# EAGLE design afron_atmega328_exp (EAGLE 6.1)
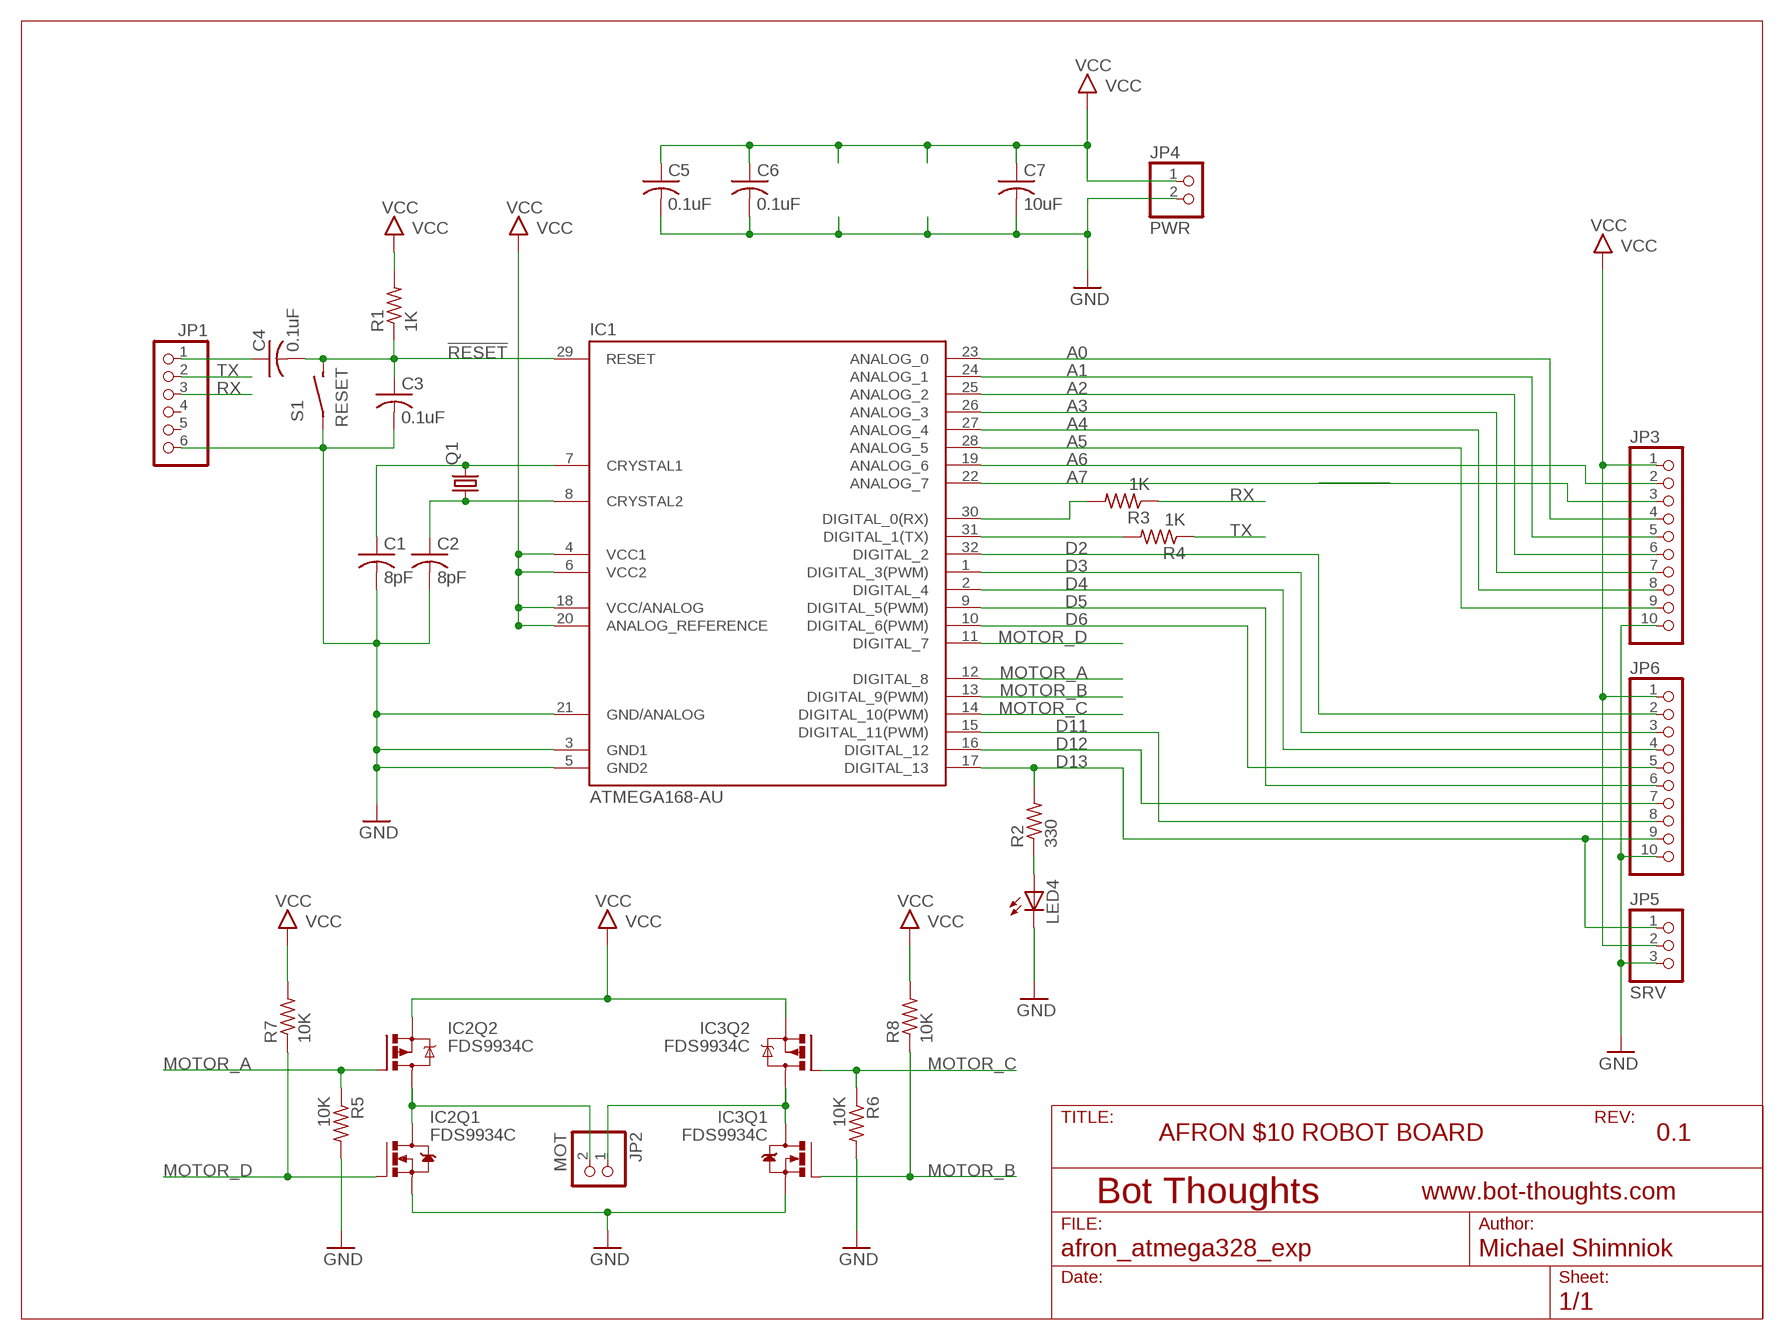
[diagram p0: schematic, sheet 1]

## Parts
C1  8pF  C-USC0603  [C0603]
C2  8pF  C-USC0603  [C0603]
C3  0.1uF  C-USC0603  [C0603]
C4  0.1uF  C-USC0603  [C0603]
C5  0.1uF  C-USC0603  [C0603]
C6  0.1uF  C-USC0603  [C0603]
C7  10uF  C-USC0805  [C0805]
IC1  ATMEGA168-AU  [TQFP32-08]
IC2  FDS9934C  [SOIC8]
IC3  FDS9934C  [SOIC8]
JP1  PINHD-1X06_2.54-S  [1X06-S]
JP2  MOT  PINHD-1X02_2.54-S  [1X02-S]
JP3  PINHD-1X10_2.54-S  [1X10-S]
JP4  PWR  PINHD-1X02_2.54-S  [1X02-S]
JP5  SRV  PINHD-1X03_2.54-S  [1X03-S]
JP6  PINHD-1X10_2.54-S  [1X10-S]
LED4  LEDSML0805  [SML0805]
Q1  CRYSTALNDK5X3  [NDK_2PAD_5X3]
R1  1K  R-US_R0603  [R0603]
R2  330  R-US_R0603  [R0603]
R3  1K  R-US_R0603  [R0603]
R4  1K  R-US_R0603  [R0603]
R5  10K  R-US_R0603  [R0603]
R6  10K  R-US_R0603  [R0603]
R7  10K  R-US_R0603  [R0603]
R8  10K  R-US_R0603  [R0603]
S1  RESET  SPST_TAC_RECT1  [6MMTACTILE_RECT]

## Nets
!RESET: C3.1 C4.2 IC1.29(RESET) R1.1 S1.P$2(S)
A0: IC1.23(ANALOG_0) JP3.4
A1: IC1.24(ANALOG_1) JP3.5
A2: IC1.25(ANALOG_2) JP3.6
A3: IC1.26(ANALOG_3) JP3.7
A4: IC1.27(ANALOG_4) JP3.8
A5: IC1.28(ANALOG_5) JP3.9
A6: IC1.19(ANALOG_6) JP3.2
A7: IC1.22(ANALOG_7) JP3.3
D2: IC1.32(DIGITAL_2) JP6.2
D3: IC1.1(DIGITAL_3(PWM)) JP6.3
D4: IC1.2(DIGITAL_4) JP6.4
D5: IC1.9(DIGITAL_5(PWM)) JP6.6
D6: IC1.10(DIGITAL_6(PWM)) JP6.5
D11: IC1.15(DIGITAL_11(PWM)) JP6.8
D12: IC1.16(DIGITAL_12) JP6.7
D13: IC1.17(DIGITAL_13) JP5.1 JP6.9 R2.2
GND: C1.2 C2.2 C5.2 C6.2 C7.2 IC1.3(GND1) IC1.5(GND2) IC1.21(GND/ANALOG) IC2.1(Q1:S) IC3.1(Q1:S) JP1.6 JP3.10 JP4.2 JP5.3 JP6.10 LED4.C R5.2 R6.2 S1.P$1(P)
MA: IC2.5(Q2:D) IC2.6(Q2:D) IC2.7(Q1:D) IC2.8(Q1:D) JP2.2
MB: IC3.5(Q2:D) IC3.6(Q2:D) IC3.7(Q1:D) IC3.8(Q1:D) JP2.1
MOTOR_A: IC1.12(DIGITAL_8) IC2.4(Q2:G) R5.1
MOTOR_B: IC1.13(DIGITAL_9(PWM)) IC3.2(Q1:G) R8.1
MOTOR_C: IC1.14(DIGITAL_10(PWM)) IC3.4(Q2:G) R6.1
MOTOR_D: IC1.11(DIGITAL_7) IC2.2(Q1:G) R7.1
N$2: C1.1 IC1.7(CRYSTAL1) Q1.P$2
N$3: C2.1 IC1.8(CRYSTAL2) Q1.P$1
N$4: C4.1 JP1.1
N$6: LED4.A R2.1
N$8: IC1.31(DIGITAL_1(TX)) R4.2
N$9: IC1.30(DIGITAL_0(RX)) R3.2
N$21: C3.2
RX: JP1.3 R3.1
TX: JP1.2 R4.1
VCC: C5.1 C6.1 C7.1 IC1.4(VCC1) IC1.6(VCC2) IC1.18(VCC/ANALOG) IC1.20(ANALOG_REFERENCE) IC2.3(Q2:S) IC3.3(Q2:S) JP3.1 JP4.1 JP5.2 JP6.1 R1.2 R7.2 R8.2
Unconnected: JP1.4 JP1.5

## Notes on the sheet
- AFRON $10 ROBOT BOARD | 0.1

## Library data of the parts
C1-C7 = rcl:C-US: CAPACITOR, American symbol
IC1 = Arduino-AVR:ATMEGA168
IC2 IC3 = mes_motor_driver:FDS9934C: Complementary MOSFET These dual N- and P-Channel enhancement mode power field effect transistors are produced using Fairchild Semiconductor’s advanced PowerTrench process that has been especially tailored to minimize on-state ressitance and yet maintain superior switching performance. These devices are well suited for low voltage and battery powered applications where low in-line power loss and fast switching are required. http://www.fairchildsemi.com/ds/FD/FDS9934C.pdf
JP1 = pinhead-2:PINHD-1X06: PIN HEADER
JP2 JP4 = pinhead-2:PINHD-1X02: PIN HEADER
JP3 JP6 = pinhead-2:PINHD-1X10: PIN HEADER
JP5 = pinhead-2:PINHD-1X03: PIN HEADER
LED4 = led:LED: LED OSRAM: - CHIPLED LG R971, LG N971, LY N971, LG Q971, LY Q971, LO R971, LY R971 LH N974, LH R974 LS Q976, LO Q976, LY Q976 LO Q996 - Hyper CHIPLED LW Q18S LB Q993, LB Q99A, LB R99A - SideLED LS A670, LO A670, LY A670, LG A670, LP A670 LB A673, LV A673, LT A673, LW A673 LH A674 LY A675 LS A676, LA A676, LO A676, LY A676, LW A676 LS A679, LY A679, LG A679 - Hyper Micro SIDELED® LS Y876, LA Y876, LO Y876, LY Y876 LT Y87S - SmartLED LW L88C, LW L88S LB L89C, LB L89S, LG L890 LS L89K, LO L89K, LY L89K LS L896, LA L896, LO L896, LY L896 - TOPLED LS T670, LO T670, LY T670, LG T670, LP T670 LSG T670, LSP T670, LSY T670, LOP T670, LYG T670 LG T671, LOG T671, LSG T671 LB T673, LV T673, LT T673, LW T673 LH T674 LS T676, LA T676, LO T676, LY T676, LB T676, LH T676, LSB T676, LW T676 LB T67C, LV T67C, LT T67C, LS T67K, LO T67K, LY T67K, LW E67C LS E67B, LA E67B, LO E67B, LY E67B, LB E67C, LV E67C, LT E67C LW T67C LS T679, LY T679, LG T679 LS T770, LO T770, LY T770, LG T770, LP T770 LB T773, LV T773, LT T773, LW T773 LH T774 LS E675, LA E675, LY E675, LS T675 LS T776, LA T776, LO T776, LY T776, LB T776 LHGB T686 LT T68C, LB T68C - Hyper Mini TOPLED® LB M676 - Mini TOPLED Santana® LG M470 LS M47K, LO M47K, LY M47K Source: http://www.osram.convergy.de LUXEON: - LUMILED® LXK2-PW12-R00, LXK2-PW12-S00, LXK2-PW14-U00, LXK2-PW14-V00 LXK2-PM12-R00, LXK2-PM12-S00, LXK2-PM14-U00 LXK2-PE12-Q00, LXK2-PE12-R00, LXK2-PE12-S00, LXK2-PE14-T00, LXK2-PE14-U00 LXK2-PB12-K00, LXK2-PB12-L00, LXK2-PB12-M00, LXK2-PB14-N00, LXK2-PB14-P00, LXK2-PB14-Q00 LXK2-PR12-L00, LXK2-PR12-M00, LXK2-PR14-Q00, LXK2-PR14-R00 LXK2-PD12-Q00, LXK2-PD12-R00, LXK2-PD12-S00 LXK2-PH12-R00, LXK2-PH12-S00 LXK2-PL12-P00, LXK2-PL12-Q00, LXK2-PL12-R00 Source: www.luxeon.com KINGBRIGHT: KA-3528ASYC Source: www.kingbright.com
Q1 = mes_crystal:CRYSTAL: CRYSTAL
R1-R8 = resistor:R-US_: RESISTOR, American symbol
S1 = mes_electromech:SPST: SPST SWITCH

## Board
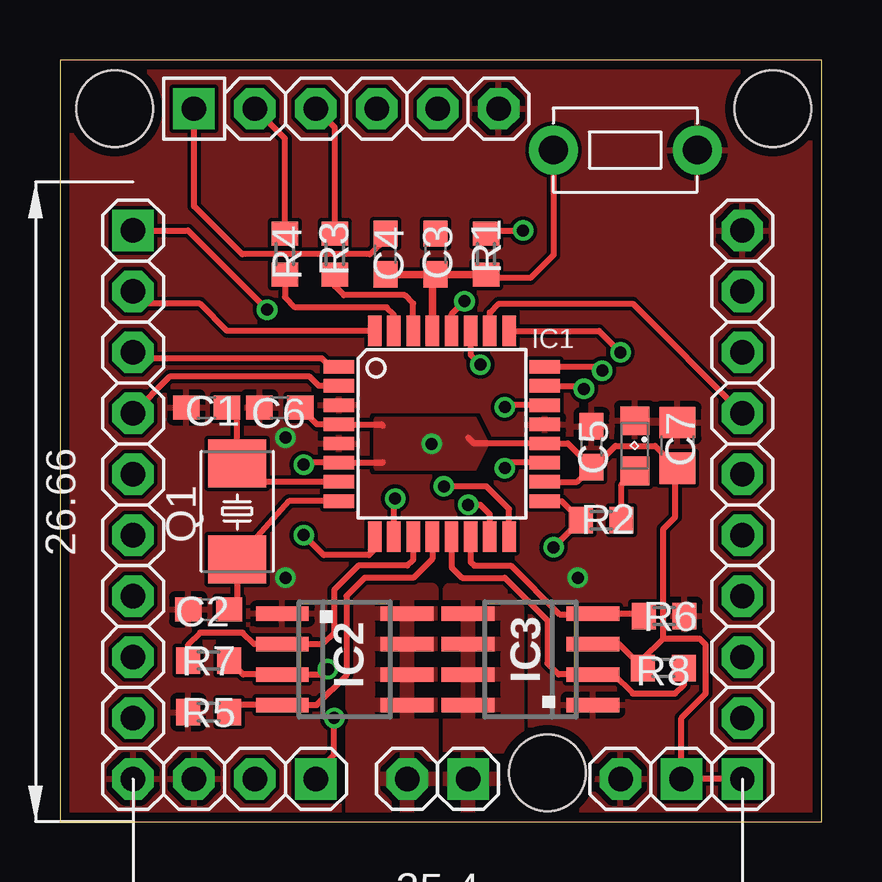
[diagram p1: board, top side]
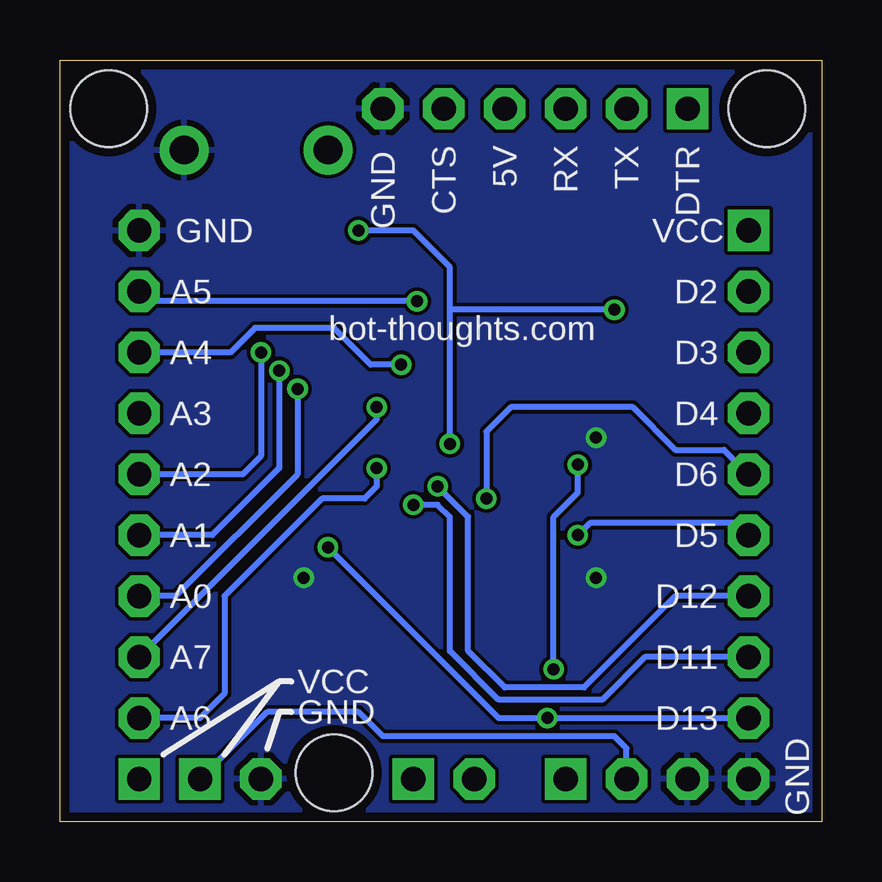
[diagram p2: board, bottom side, seen from below]

Size 31.75 x 31.75 mm. Coordinates in mm from the lower left corner, seen from the top.
Outline: 0,0 31.75,0 31.75,31.75 0,31.75 0,0
Copper layers (1*16): Top 0.0356mm / dielectric 1.5011mm / Bottom 0.0356mm
Design rules: minimum track width 6mil, minimum drill 13mil, track to track 6mil, track to pad 6mil, pad to pad 6mil, via to via 6mil, smd to smd 6mil, copper to edge 15mil, drill to drill 6mil, minimum pad ring 7mil, minimum via ring 7mil, stop-mask expansion 4mil, vias tented up to drill 20mil, thermal gap 10mil
Holes 3.2 mm at 2.29,29.72 29.72,29.72 20.32,2.03

### Footprints (pad centres in the part's own frame; a part is rotated, then mirrored left to right if it is on the bottom)
C0603 = smd 1.1 x 1: 1 -0.85,0; 2 0.85,0
C0805 = smd 1.3 x 1.5: 1 -0.95,0; 2 0.95,0
TQFP32-08 = smd 1.27 x 0.559: 1 -4.293,2.8; 2 -4.293,2; 3 -4.293,1.2; 4 -4.293,0.4; 5 -4.293,-0.4; 6 -4.293,-1.2; 7 -4.293,-2; 8 -4.293,-2.8; 17 4.293,-2.8; 18 4.293,-2; 19 4.293,-1.2; 20 4.293,-0.4; 21 4.293,0.4; 22 4.293,1.2; 23 4.293,2; 24 4.293,2.8 | smd 0.559 x 1.27: 9 -2.8,-4.293; 10 -2,-4.293; 11 -1.2,-4.293; 12 -0.4,-4.293; 13 0.4,-4.293; 14 1.2,-4.293; 15 2,-4.293; 16 2.8,-4.293; 25 2.8,4.293; 26 2,4.293; 27 1.2,4.293; 28 0.4,4.293; 29 -0.4,4.293; 30 -1.2,4.293; 31 -2,4.293; 32 -2.8,4.293
SOIC8 = smd 0.6 x 2.2: 1 -1.905,-2.6; 2 -0.635,-2.6; 3 0.635,-2.6; 4 1.905,-2.6; 5 1.905,2.6; 6 0.635,2.6; 7 -0.635,2.6; 8 -1.905,2.6
1X06-S = drill 1.016 square: 1 -6.35,0 | drill 1.016 octagon: 2 -3.81,0; 3 -1.27,0; 4 1.27,0; 5 3.81,0; 6 6.35,0
1X02-S = drill 1.016 square: 1 -1.27,0 | drill 1.016 octagon: 2 1.27,0
1X10-S = drill 1.016 square: 1 -11.43,0 | drill 1.016 octagon: 2 -8.89,0; 3 -6.35,0; 4 -3.81,0; 5 -1.27,0; 6 1.27,0; 7 3.81,0; 8 6.35,0; 9 8.89,0; 10 11.43,0
1X03-S = drill 1.016 square: 1 -2.54,0 | drill 1.016 octagon: 2 0,0; 3 2.54,0
SML0805 = smd 1.2 x 1.2: A 1.05,0; C -1.05,0
NDK_2PAD_5X3 = smd 2 x 2.4: P$1 -2,0; P$2 2,0
R0603 = smd 1 x 1.1: 1 -0.85,0; 2 0.85,0
6MMTACTILE_RECT = drill 1.2: P$1 -3,0; P$2 3,0

### Placement (x,y rotation side)
C1  6.12,17.26 180 top
C2  6.2,8.85 180 top
C3  15.66,23.66 90 top
C4  13.56,23.66 270 top
C5  22.16,15.62 90 top
C6  9.16,17.26 180 top
C7  25.74,15.68 90 top
IC1  15.92,16.16 0 top
IC2  11.87,6.76 270 top
IC3  19.62,6.76 90 top
JP1  11.94,29.72 0 top
JP2  15.75,1.78 180 top
JP3  28.45,13.21 90 top
JP4  24.64,1.78 180 top
JP5  8.13,1.78 180 top
JP6  3.05,13.21 270 top
LED4  23.96,15.66 270 top
Q1  7.39,12.93 90 top
R1  17.76,23.66 90 top
R2  22.56,12.56 180 top
R3  11.46,23.66 270 top
R4  9.38,23.66 270 top
R5  6.2,4.56 180 top
R6  25.19,8.57 0 top
R7  6.2,6.72 0 top
R8  25.16,6.4 180 top
S1  23.57,28 180 top

### Tracks (layer width: path | path; a pad name or v marks a point on that pad's centre or on a via)
!RESET
  Top 0.254: S1.P$2 20.57,23.62 19.61,22.66 18.26,22.66 18.16,22.76 17.81,22.76 R1.1
  Top 0.305: C3.1 C4.2 | IC1.29 15.52,23.01 C3.1 | R1.1 C3.1
A0  (via drill 0.5)
  Top 0.254: IC1.23 21.72,18.16 v21.84,18.03
  Bottom 0.254: v21.84,18.03 21.84,14.48 26.92,9.4 JP3.4
A1  (via drill 0.5)
  Top 0.254: IC1.24 22.44,18.96 v22.61,18.8
  Bottom 0.254: v22.61,18.8 22.61,14.73 25.4,11.94 JP3.5
A2  (via drill 0.5)
  Top 0.254: IC1.25 22.47,20.45 v23.37,19.56
  Bottom 0.254: v23.37,19.56 23.37,15.24 24.13,14.48 JP3.6
A3
  Top 0.254: IC1.26 17.92,21.23 18.29,21.59 23.88,21.59 JP3.7
A4  (via drill 0.5)
  Top 0.254: IC1.27 17.12,19.45 v17.53,19.05
  Bottom 0.254: v17.53,19.05 18.8,19.05 20.32,20.57 23.62,20.57 24.64,19.56 JP3.8
A5  (via drill 0.5)
  Top 0.254: IC1.28 16.32,21.15 v16.86,21.69
  Bottom 0.254: v16.86,21.69 28.04,21.69 JP3.9
A6  (via drill 0.5)
  Top 0.254: IC1.19 18.77,14.96 v18.54,14.73
  Bottom 0.254: v18.54,14.73 18.54,13.97 19.05,13.46 20.83,13.46 24.89,9.4 24.89,5.33 25.91,4.32 JP3.2
A7  (via drill 0.5)
  Top 0.254: IC1.22 18.63,17.36 v18.54,17.27
  Bottom 0.254: v18.54,17.27 18.54,16.76 JP3.3
D2
  Top 0.254: IC1.32 6.98,20.45 5.84,21.59 3.56,21.59 JP6.2
D3
  Top 0.254: IC1.1 11.26,18.96 10.92,19.3 3.3,19.3 JP6.3
D4
  Top 0.254: IC1.2 10.79,18.16 10.41,18.54 4.57,18.54 JP6.4
D5  (via drill 0.5)
  Top 0.254: IC1.9 13.12,11.35 12.88,11.11 10.99,11.11 v10.16,11.94
  Bottom 0.254: v10.16,11.94 9.65,12.45 3.56,12.45 JP6.6
D6  (via drill 0.5)
  Top 0.254: IC1.10 13.92,13.42 v13.97,13.46
  Bottom 0.254: v13.97,13.46 13.97,16.26 12.95,17.27 7.87,17.27 6.1,15.49 4.06,15.49 JP6.5
D11  (via drill 0.5)
  Top 0.254: IC1.15 17.92,12.81 17.53,13.21 v17.02,13.21
  Bottom 0.254: JP6.8 7.37,6.86 9.14,5.08 13.46,5.08 15.49,7.11 15.49,12.7 16,13.21 v17.02,13.21
D12  (via drill 0.5)
  Top 0.254: IC1.16 18.72,13.03 17.78,13.97 v16,13.97
  Bottom 0.254: JP6.7 6.1,9.4 9.91,5.59 13.21,5.59 14.73,7.11 14.73,12.7 v16,13.97
D13  (via drill 0.5)
  Top 0.254: IC1.17 20.91,13.36 R2.2 21.62,12.46 v20.57,11.43 | JP5.1 10.67,2.03 11.43,2.79 v11.43,4.32
  Bottom 0.254: v20.57,11.43 13.46,4.32 v11.43,4.32 JP6.9
GND  (via drill 0.5)
  other vias: 9.4,16 9.4,10.16 21.59,10.16
  pour Bottom: 0.3,31.76 31.63,31.76 31.63,-0.25 0.3,-0.25
  pour Top (rank 3): 0.3,31.76 31.63,31.76 31.63,-0.25 0.3,-0.25
MA
  pour Top (rank 2): 12.19,9.65 15.49,9.65 15.49,0 12.19,0
MB
  pour Top: 16.26,9.65 19.05,9.65 19.05,0 16.26,0
MOTOR_A
  Top 0.254: IC1.12 15.52,10.95 14.73,10.16 12.7,10.16 11.94,9.4 11.94,6.1 10.7,4.86 IC2.4 7.28,4.86 R5.1
MOTOR_B
  Top 0.254: IC1.13 16.32,10.6 16.76,10.16 18.54,10.16 20.32,8.38 20.32,6.6 20.8,6.13 IC3.2 23.08,6.13 23.88,5.33 25.65,5.33 26.01,5.69 R8.1
MOTOR_C
  Top 0.254: IC1.14 17.12,10.82 17.27,10.67 18.8,10.67 20.83,8.64 22.18,8.64 IC3.4 24.24,8.67 R6.1
MOTOR_D
  Top 0.254: R7.1 5.35,7.38 5.84,7.87 7.62,7.87 8.1,7.4 IC2.2 10.95,7.4 11.43,7.87 11.43,9.65 12.45,10.67 14.48,10.67 14.72,10.91 IC1.11
N$2
  Top 0.254: IC1.7 8.41,14.16 Q1.P$2 7.39,16.84 C1.1
N$3
  Top 0.254: C2.1 7.39,9.28 Q1.P$1 9.56,13.36 IC1.8
N$4
  Top 0.254: C4.1 13.56,24.29 12.92,23.65 7.6,23.65 5.59,25.65 JP1.1
N$6
  Top 0.254: R2.1 23.41,14.06 LED4.A
N$8
  Top 0.254: IC1.31 13.92,21.13 13.62,21.44 9.81,21.44 9.38,21.87 R4.2
N$9
  Top 0.254: IC1.30 14.72,21.6 14.38,21.94 11.84,21.94 11.46,22.32 R3.2
RX
  Top 0.254: R3.1 11.46,28.93 JP1.3
TX
  Top 0.254: R4.1 9.38,28.47 JP1.2
VCC  (via drill 0.5)
  Top 0.254: 10.16,17.31 C6.1 10.71,16.56 IC1.4 13.41,16.56 13.46,16.51 | IC1.18 21.55,14.16 C5.1 | C5.1 21.17,15.76 IC1.20 17.26,15.76 17.02,16 | C5.1 22.27,14.77 23.16,15.66 24.81,15.66 C7.1 25.65,14.64 25.65,12.7 25.15,12.19 25.15,7.62 | R7.2 7.64,6.13 IC2.3 10.95,6.13 v11.18,6.35 | IC3.3 23.31,7.4 R8.2 24.31,6.78 25.15,7.62 | 25.15,7.62 26.67,7.62 26.92,7.37 26.92,5.33 25.91,4.32 JP4.1 JP3.1 | v10.16,14.88 10.24,14.96 IC1.6 13.44,14.96 13.46,14.99 | R1.2 18.02,24.65 18.03,24.64 v19.3,24.64 | JP6.1 5.33,24.64 v8.64,21.34
  Bottom 0.254: v11.18,6.35 11.18,12.7 10.16,13.72 v10.16,14.88 | v15.49,15.75 15.49,21.34 | 15.49,21.34 15.49,23.11 17.02,24.64 v19.3,24.64 | v8.64,21.34 15.49,21.34 | JP5.2 8.13,3.05 8.64,3.56 18.29,3.56 19.3,4.57 23.11,4.57 JP4.1
  pour Top: 13.21,16.76 17.27,16.76 17.78,15.75 17.27,14.73 13.21,14.73

### Text on the board
bNames: DTR | TX | RX | 5V | CTS | GND | VCC | GND | D2 | A5 | D3 | bot-thoughts.com | A4 | D4 | A3 | D6 | A2 | D5 | A1 | D12 | A0 | D11 | A7 | D13 | VCC | GND | A6 | GND